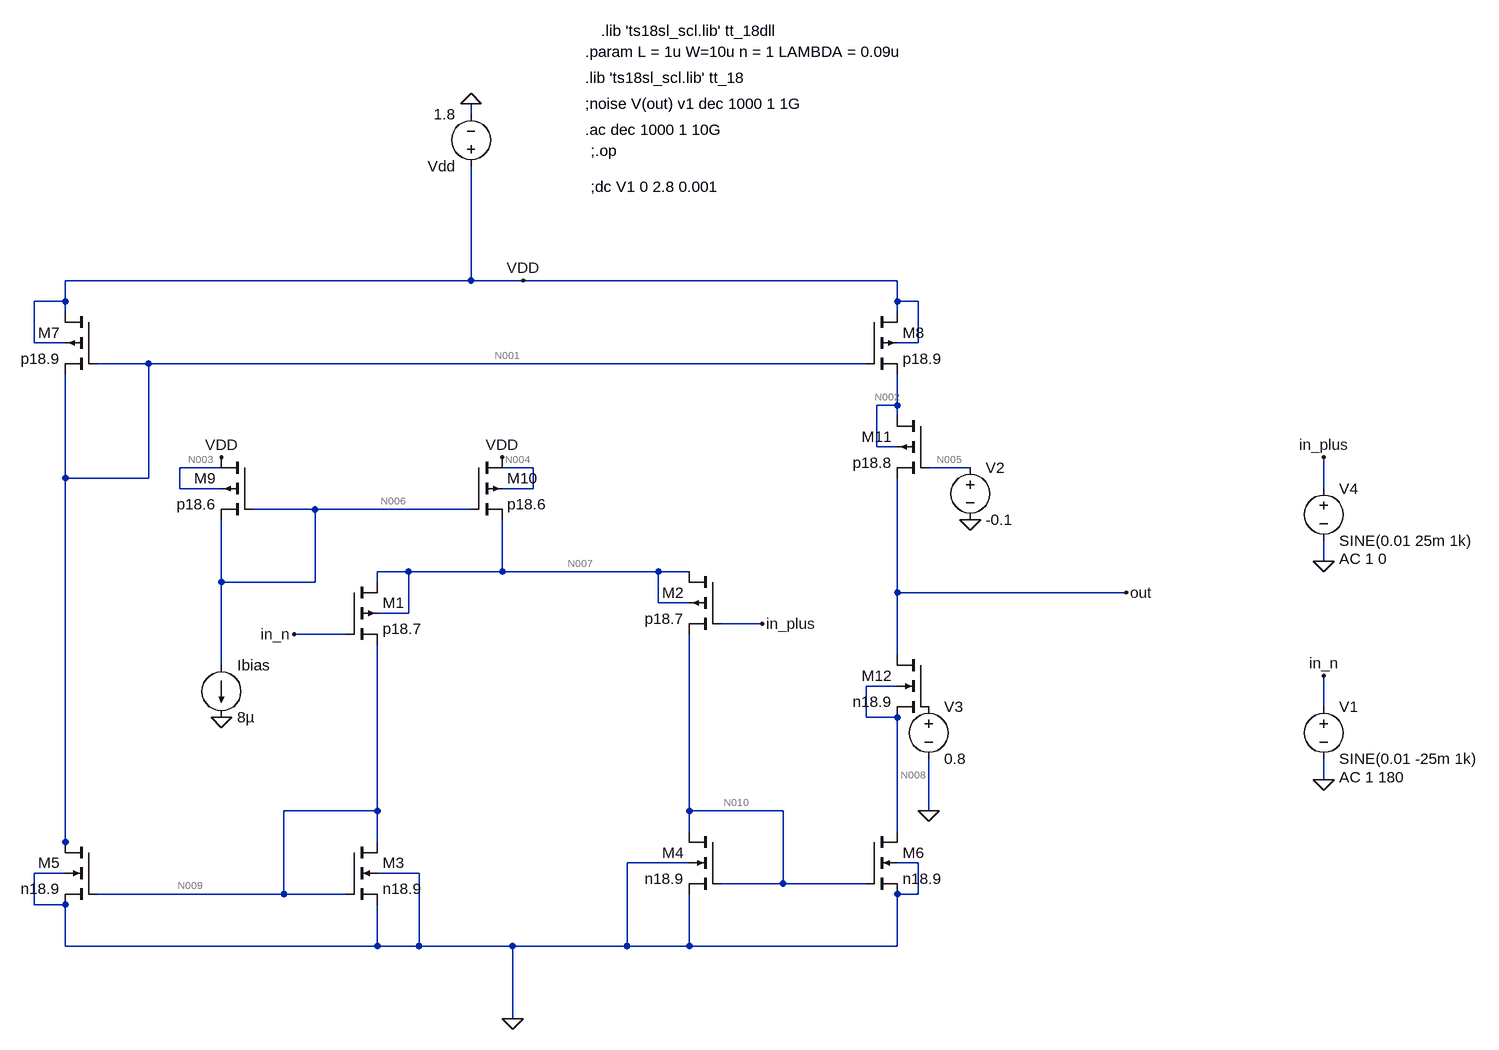
[diagram p0: schematic neural - Copy.asc]
neural - Copy.asc, the LTspice schematic file:
Version 4
SHEET 1 3032 1344
WIRE 432 -176 432 -192
WIRE 432 80 432 -96
WIRE 432 80 -192 80
WIRE 512 80 432 80
WIRE 1088 80 512 80
WIRE -192 112 -192 80
WIRE -192 112 -240 112
WIRE 1088 112 1088 80
WIRE 1120 112 1088 112
WIRE -192 128 -192 112
WIRE 1088 128 1088 112
WIRE -240 176 -240 112
WIRE -192 176 -240 176
WIRE 1120 176 1120 112
WIRE 1120 176 1088 176
WIRE -64 208 -144 208
WIRE 1040 208 -64 208
WIRE 1088 272 1088 224
WIRE 1088 272 1056 272
WIRE 1088 288 1088 272
WIRE 1056 336 1056 272
WIRE 1088 336 1056 336
WIRE 48 368 -16 368
WIRE 528 368 480 368
WIRE 1200 368 1136 368
WIRE -192 384 -192 224
WIRE -64 384 -64 208
WIRE -64 384 -192 384
WIRE -16 400 -16 368
WIRE 48 400 -16 400
WIRE 528 400 528 368
WIRE 528 400 480 400
WIRE 1744 400 1744 352
WIRE 192 432 96 432
WIRE 432 432 192 432
WIRE 1744 512 1744 480
WIRE 336 528 288 528
WIRE 480 528 480 448
WIRE 480 528 336 528
WIRE 720 528 480 528
WIRE 768 528 720 528
WIRE 48 544 48 448
WIRE 192 544 192 432
WIRE 192 544 48 544
WIRE 288 544 288 528
WIRE 1088 560 1088 384
WIRE 1440 560 1088 560
WIRE 720 576 720 528
WIRE 768 576 720 576
WIRE 336 592 336 528
WIRE 336 592 288 592
WIRE 880 608 816 608
WIRE 240 624 160 624
WIRE 1088 656 1088 560
WIRE 48 672 48 544
WIRE 1088 704 1040 704
WIRE 1744 736 1744 688
WIRE 1040 752 1040 704
WIRE 1088 752 1040 752
WIRE 1744 848 1744 816
WIRE 288 896 288 640
WIRE 288 896 144 896
WIRE 768 896 768 624
WIRE 912 896 768 896
WIRE 1136 896 1136 816
WIRE 768 928 768 896
WIRE 1088 928 1088 752
WIRE -192 944 -192 384
WIRE 288 944 288 896
WIRE -192 960 -192 944
WIRE 768 976 672 976
WIRE 1120 976 1088 976
WIRE -192 992 -240 992
WIRE 352 992 288 992
WIRE 912 1008 912 896
WIRE 912 1008 816 1008
WIRE 1040 1008 912 1008
WIRE 144 1024 144 896
WIRE 144 1024 -144 1024
WIRE 240 1024 144 1024
WIRE 1120 1024 1120 976
WIRE 1120 1024 1088 1024
WIRE -240 1040 -240 992
WIRE -192 1040 -240 1040
WIRE -192 1104 -192 1040
WIRE 288 1104 288 1040
WIRE 288 1104 -192 1104
WIRE 352 1104 352 992
WIRE 352 1104 288 1104
WIRE 496 1104 352 1104
WIRE 672 1104 672 976
WIRE 672 1104 496 1104
WIRE 768 1104 768 1024
WIRE 768 1104 672 1104
WIRE 1088 1104 1088 1024
WIRE 1088 1104 768 1104
WIRE 496 1216 496 1104
FLAG 48 752 0
FLAG 1440 560 out
FLAG 1744 848 0
FLAG 880 608 in_plus
FLAG 1136 896 0
FLAG 1200 448 0
FLAG 496 1216 0
FLAG 512 80 VDD
FLAG 48 352 VDD
FLAG 432 -192 0
FLAG 1744 512 0
FLAG 160 624 in_n
FLAG 1744 352 in_plus
FLAG 1744 688 in_n
FLAG 480 352 VDD
DATAFLAG -192 384 ""
DATAFLAG 512 528 ""
DATAFLAG 912 1008 ""
DATAFLAG 256 1104 ""
DATAFLAG 1120 144 ""
DATAFLAG 224 896 ""
DATAFLAG 1088 816 ""
SYMBOL nmos4 816 928 M0
SYMATTR InstName M4
SYMATTR Value n18.9
SYMATTR Value2 l=3u w=27u ad={5*W*LAMBDA} as={5*W*LAMBDA} pd={10*LAMBDA+2*W} ps={10*LAMBDA+2*W}
SYMBOL voltage 432 -80 R180
WINDOW 123 24 -12 Left 2
WINDOW 39 0 0 Left 0
SYMATTR InstName Vdd
SYMATTR Value 1.8
SYMBOL pmos4 432 352 R0
SYMATTR InstName M10
SYMATTR Value p18.6
SYMATTR Value2 l=1.2u w=1.2u ad={5*W*LAMBDA} as={5*W*LAMBDA} pd={10*LAMBDA+2*W} ps={10*LAMBDA+2*W}
SYMBOL pmos4 96 352 M0
SYMATTR InstName M9
SYMATTR Value p18.6
SYMATTR Value2 l=1.2u w=1.2u ad={5*W*LAMBDA} as={5*W*LAMBDA} pd={10*LAMBDA+2*W} ps={10*LAMBDA+2*W}
SYMBOL nmos4 240 944 R0
SYMATTR InstName M3
SYMATTR Value n18.9
SYMATTR Value2 l=3u w=27u ad={5*W*LAMBDA} as={5*W*LAMBDA} pd={10*LAMBDA+2*W} ps={10*LAMBDA+2*W}
SYMBOL pmos4 240 544 R0
SYMATTR InstName M1
SYMATTR Value p18.7
SYMATTR Value2 l=180n w=80u ad={5*W*LAMBDA} as={5*W*LAMBDA} pd={10*LAMBDA+2*W} ps={10*LAMBDA+2*W}
SYMBOL pmos4 1040 128 R0
SYMATTR InstName M8
SYMATTR Value p18.9
SYMATTR Value2 l=9u w=2u ad={5*W*LAMBDA} as={5*W*LAMBDA} pd={10*LAMBDA+2*W} ps={10*LAMBDA+2*W}
SYMBOL pmos4 -144 128 M0
SYMATTR InstName M7
SYMATTR Value p18.9
SYMATTR Value2 l=9u w=2u ad={5*W*LAMBDA} as={5*W*LAMBDA} pd={10*LAMBDA+2*W} ps={10*LAMBDA+2*W}
SYMBOL nmos4 -144 944 M0
SYMATTR InstName M5
SYMATTR Value n18.9
SYMATTR Value2 l=3u w=27u ad={5*W*LAMBDA} as={5*W*LAMBDA} pd={10*LAMBDA+2*W} ps={10*LAMBDA+2*W}
SYMBOL nmos4 1040 928 R0
SYMATTR InstName M6
SYMATTR Value n18.9
SYMATTR Value2 l=3u w=27u ad={5*W*LAMBDA} as={5*W*LAMBDA} pd={10*LAMBDA+2*W} ps={10*LAMBDA+2*W}
SYMBOL current 48 672 R0
WINDOW 123 0 0 Left 0
WINDOW 39 0 0 Left 0
SYMATTR InstName Ibias
SYMATTR Value 8µ
SYMBOL pmos4 1136 288 M0
SYMATTR InstName M11
SYMATTR Value p18.8
SYMATTR Value2 l=1u w=90u ad={5*W*LAMBDA} as={5*W*LAMBDA} pd={10*LAMBDA+2*W} ps={10*LAMBDA+2*W}
SYMBOL nmos4 1136 656 M0
SYMATTR InstName M12
SYMATTR Value n18.9
SYMATTR Value2 l=5u w=40u ad={5*W*LAMBDA} as={5*W*LAMBDA} pd={10*LAMBDA+2*W} ps={10*LAMBDA+2*W}
SYMBOL voltage 1744 720 R0
WINDOW 123 24 124 Left 2
WINDOW 39 0 0 Left 0
SYMATTR Value2 AC 1 180
SYMATTR InstName V1
SYMATTR Value SINE(0.01 -25m 1k)
SYMBOL voltage 1200 352 R0
WINDOW 123 0 0 Left 0
WINDOW 39 0 0 Left 0
SYMATTR InstName V2
SYMATTR Value -0.1
SYMBOL voltage 1136 720 R0
WINDOW 123 0 0 Left 0
WINDOW 39 0 0 Left 0
SYMATTR InstName V3
SYMATTR Value 0.8
SYMBOL voltage 1744 384 R0
WINDOW 123 24 124 Left 2
WINDOW 39 0 0 Left 0
SYMATTR Value2 AC 1 0
SYMATTR InstName V4
SYMATTR Value SINE(0.01 25m 1k)
SYMBOL pmos4 816 528 M0
SYMATTR InstName M2
SYMATTR Value p18.7
SYMATTR Value2 l=180n w=80u ad={5*W*LAMBDA} as={5*W*LAMBDA} pd={10*LAMBDA+2*W} ps={10*LAMBDA+2*W}
TEXT 608 -232 Left 2 !.lib 'ts18sl_scl.lib' tt_18
TEXT 608 -272 Left 2 !.param L = 1u W=10u n = 1 LAMBDA = 0.09u
TEXT 616 -120 Left 2 !;.op
TEXT 608 -152 Left 2 !.ac dec 1000 1 10G
TEXT 616 -64 Left 2 !;dc V1 0 2.8 0.001
TEXT 608 -192 Left 2 !;noise V(out) v1 dec 1000 1 1G
TEXT 632 -304 Left 2 !.lib 'ts18sl_scl.lib' tt_18dll

The netlist it stands for:
* neural - Copy.asc
M4 N010 N010 0 0 n18.9 l=3u w=27u ad={5*W*LAMBDA} as={5*W*LAMBDA} pd={10*LAMBDA+2*W} ps={10*LAMBDA+2*W}
Vdd VDD 0 1.8
M10 VDD N006 N007 N004 p18.6 l=1.2u w=1.2u ad={5*W*LAMBDA} as={5*W*LAMBDA} pd={10*LAMBDA+2*W} ps={10*LAMBDA+2*W}
M9 VDD N006 N006 N003 p18.6 l=1.2u w=1.2u ad={5*W*LAMBDA} as={5*W*LAMBDA} pd={10*LAMBDA+2*W} ps={10*LAMBDA+2*W}
M3 N009 N009 0 0 n18.9 l=3u w=27u ad={5*W*LAMBDA} as={5*W*LAMBDA} pd={10*LAMBDA+2*W} ps={10*LAMBDA+2*W}
M1 N007 in_n N009 N007 p18.7 l=180n w=80u ad={5*W*LAMBDA} as={5*W*LAMBDA} pd={10*LAMBDA+2*W} ps={10*LAMBDA+2*W}
M8 VDD N001 N002 VDD p18.9 l=9u w=2u ad={5*W*LAMBDA} as={5*W*LAMBDA} pd={10*LAMBDA+2*W} ps={10*LAMBDA+2*W}
M7 VDD N001 N001 VDD p18.9 l=9u w=2u ad={5*W*LAMBDA} as={5*W*LAMBDA} pd={10*LAMBDA+2*W} ps={10*LAMBDA+2*W}
M5 N001 N009 0 0 n18.9 l=3u w=27u ad={5*W*LAMBDA} as={5*W*LAMBDA} pd={10*LAMBDA+2*W} ps={10*LAMBDA+2*W}
M6 N008 N010 0 0 n18.9 l=3u w=27u ad={5*W*LAMBDA} as={5*W*LAMBDA} pd={10*LAMBDA+2*W} ps={10*LAMBDA+2*W}
Ibias N006 0 8µ
M11 N002 N005 out N002 p18.8 l=1u w=90u ad={5*W*LAMBDA} as={5*W*LAMBDA} pd={10*LAMBDA+2*W} ps={10*LAMBDA+2*W}
M12 out P001 N008 N008 n18.9 l=5u w=40u ad={5*W*LAMBDA} as={5*W*LAMBDA} pd={10*LAMBDA+2*W} ps={10*LAMBDA+2*W}
V1 in_n 0 SINE(0.01 -25m 1k) AC 1 180
V2 N005 0 -0.1
V3 P001 0 0.8
V4 in_plus 0 SINE(0.01 25m 1k) AC 1 0
M2 N007 in_plus N010 N007 p18.7 l=180n w=80u ad={5*W*LAMBDA} as={5*W*LAMBDA} pd={10*LAMBDA+2*W} ps={10*LAMBDA+2*W}
.model NMOS NMOS
.model PMOS PMOS
.lib standard.mos
.lib 'ts18sl_scl.lib' tt_18
.param L = 1u W=10u n = 1 LAMBDA = 0.09u
;.op
.ac dec 1000 1 10G
;dc V1 0 2.8 0.001
;noise V(out) v1 dec 1000 1 1G
.lib 'ts18sl_scl.lib' tt_18dll
.backanno
.end

* Results of the author's LTspice run, read from the files saved beside the schematic
* Operating Point, zero values left out:
*   V(n010) = 405.9 mV
*   V(vdd) = 1.8 V
*   V(n006) = 881.5 mV
*   V(n007) = 425 mV
*   V(n004) = 1.444 V
*   V(n003) = 1.451 V
*   V(n009) = 405.9 mV
*   V(in_n) = 10 mV
*   V(n001) = 507 mV
*   V(n002) = 735.2 mV
*   V(n008) = 396.5 mV
*   V(n005) = -100 mV
*   V(out) = 733.3 mV
*   V(p001) = 800 mV
*   V(in_plus) = 10 mV
*   Id(M11) = 4.06 µA
*   Is(M11) = -4.06 µA
*   Id(M7) = 4.068 µA
*   Ib(M7) = 1.293 pA
*   Is(M7) = -4.068 µA
*   Id(M8) = 4.06 µA
*   Ib(M8) = 1.065 pA
*   Is(M8) = -4.06 µA
*   Id(M2) = 4.061 µA
*   Is(M2) = -4.061 µA
*   Id(M1) = 4.061 µA
*   Is(M1) = -4.061 µA
*   Id(M9) = 8 µA
*   Ib(M9) = -1.451 pA
*   Is(M9) = -8 µA
*   Id(M10) = 8.122 µA
*   Ib(M10) = -1.444 pA
*   Is(M10) = -8.122 µA
*   Id(M12) = 4.06 µA
*   Is(M12) = -4.06 µA
*   Id(M6) = 4.06 µA
*   Is(M6) = -4.06 µA
*   Id(M5) = 4.068 µA
*   Is(M5) = -4.068 µA
*   Id(M3) = 4.061 µA
*   Is(M3) = -4.061 µA
*   Id(M4) = 4.061 µA
*   Is(M4) = -4.061 µA
*   I(Ibias) = 8 µA
*   I(Vdd) = -24.25 µA